# EAGLE design Clockdistributor (EAGLE 9.3.1)
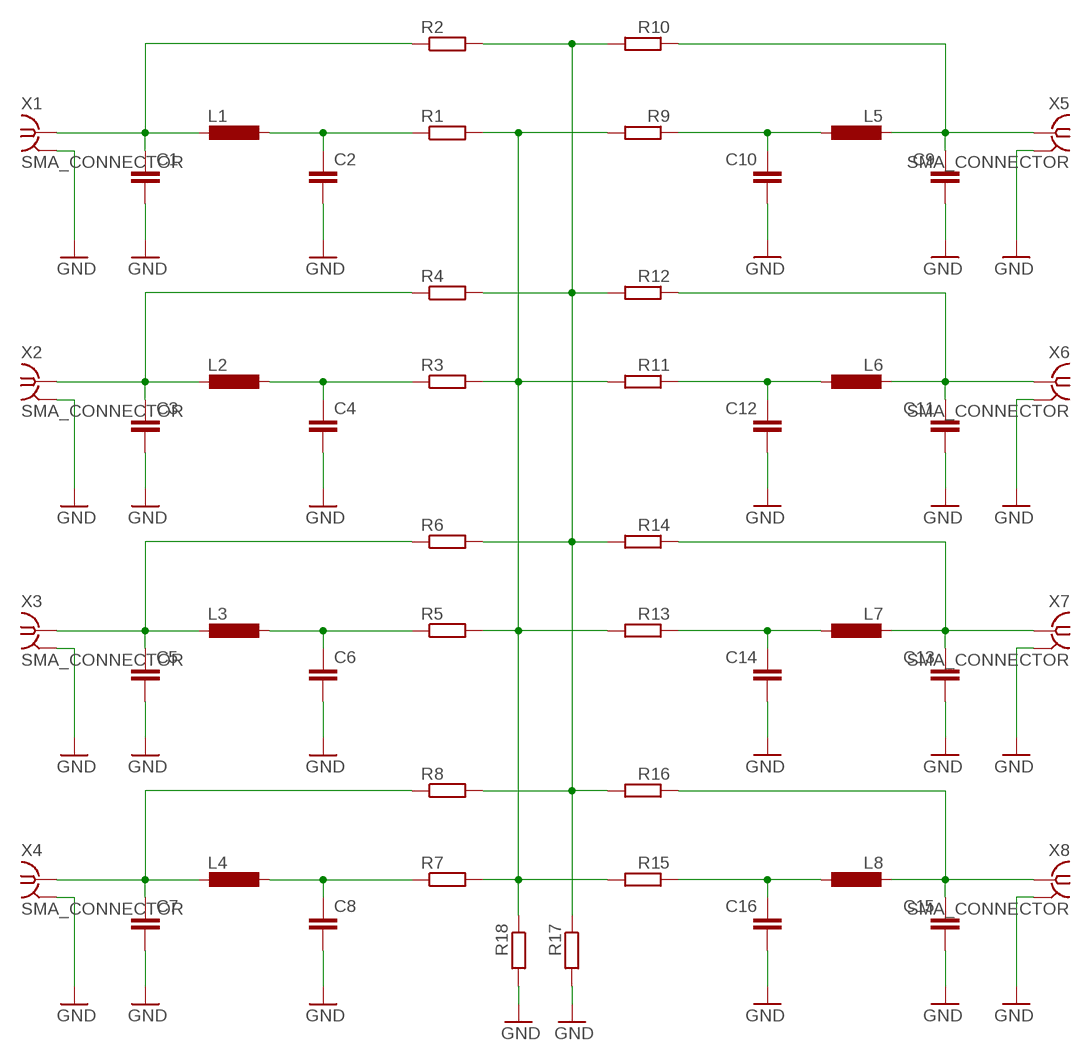
[diagram p0: schematic, sheet 1]

## Parts
C1  C-EUC0603  [C0603]
C2  C-EUC0603  [C0603]
C3  C-EUC0603  [C0603]
C4  C-EUC0603  [C0603]
C5  C-EUC0603  [C0603]
C6  C-EUC0603  [C0603]
C7  C-EUC0603  [C0603]
C8  C-EUC0603  [C0603]
C9  C-EUC0603  [C0603]
C10  C-EUC0603  [C0603]
C11  C-EUC0603  [C0603]
C12  C-EUC0603  [C0603]
C13  C-EUC0603  [C0603]
C14  C-EUC0603  [C0603]
C15  C-EUC0603  [C0603]
C16  C-EUC0603  [C0603]
L1  L-EUL2012C  [L2012C]
L2  L-EUL2012C  [L2012C]
L3  L-EUL2012C  [L2012C]
L4  L-EUL2012C  [L2012C]
L5  L-EUL2012C  [L2012C]
L6  L-EUL2012C  [L2012C]
L7  L-EUL2012C  [L2012C]
L8  L-EUL2012C  [L2012C]
R1  R-EU_R0603  [R0603]
R2  R-EU_R0603  [R0603]
R3  R-EU_R0603  [R0603]
R4  R-EU_R0603  [R0603]
R5  R-EU_R0603  [R0603]
R6  R-EU_R0603  [R0603]
R7  R-EU_R0603  [R0603]
R8  R-EU_R0603  [R0603]
R9  R-EU_R0603  [R0603]
R10  R-EU_R0603  [R0603]
R11  R-EU_R0603  [R0603]
R12  R-EU_R0603  [R0603]
R13  R-EU_R0603  [R0603]
R14  R-EU_R0603  [R0603]
R15  R-EU_R0603  [R0603]
R16  R-EU_R0603  [R0603]
R17  R-EU_R0603  [R0603]
R18  R-EU_R0603  [R0603]
X1  SMA_CONNECTOR  [J502-ND-142-0711-821/826]
X2  SMA_CONNECTOR  [J502-ND-142-0711-821/826]
X3  SMA_CONNECTOR  [J502-ND-142-0711-821/826]
X4  SMA_CONNECTOR  [J502-ND-142-0711-821/826]
X5  SMA_CONNECTOR  [J502-ND-142-0711-821/826]
X6  SMA_CONNECTOR  [J502-ND-142-0711-821/826]
X7  SMA_CONNECTOR  [J502-ND-142-0711-821/826]
X8  SMA_CONNECTOR  [J502-ND-142-0711-821/826]

## Nets
GND: C1.2 C2.2 C3.2 C4.2 C5.2 C6.2 C7.2 C8.2 C9.2 C10.2 C11.2 C12.2 C13.2 C14.2 C15.2 C16.2 R17.2 R18.2 X1.G@1 X1.G@2 X1.G@3 X1.G@4 X2.G@1 X2.G@2 X2.G@3 X2.G@4 X3.G@1 X3.G@2 X3.G@3 X3.G@4 X4.G@1 X4.G@2 X4.G@3 X4.G@4 X5.G@1 X5.G@2 X5.G@3 X5.G@4 X6.G@1 X6.G@2 X6.G@3 X6.G@4 X7.G@1 X7.G@2 X7.G@3 X7.G@4 X8.G@1 X8.G@2 X8.G@3 X8.G@4
N$1: C1.1 L1.2 R2.1 X1.1
N$2: C2.1 L1.1 R1.1
N$3: C3.1 L2.2 R4.1 X2.1
N$4: C4.1 L2.1 R3.1
N$5: C5.1 L3.2 R6.1 X3.1
N$6: C6.1 L3.1 R5.1
N$7: C7.1 L4.2 R8.1 X4.1
N$8: C8.1 L4.1 R7.1
N$9: C9.1 L5.2 R10.1 X5.1
N$10: C10.1 L5.1 R9.1
N$11: C11.1 L6.2 R12.1 X6.1
N$12: C12.1 L6.1 R11.1
N$13: C13.1 L7.2 R14.1 X7.1
N$14: C14.1 L7.1 R13.1
N$15: C15.1 L8.2 R16.1 X8.1
N$16: C16.1 L8.1 R15.1
N$17: R2.2 R4.2 R6.2 R8.2 R10.2 R12.2 R14.2 R16.2 R17.1
N$21: R1.2 R3.2 R5.2 R7.2 R9.2 R11.2 R13.2 R15.2 R18.1

## Library data of the parts
C1-C16 = rcl:C-EU: CAPACITOR, European symbol
L1-L8 = rcl:L-EU: INDUCTOR, European symbol
R1-R18 = resistor:R-EU_: RESISTOR, European symbol
X1-X8 = rf:SMA_CONNECTOR

## Board
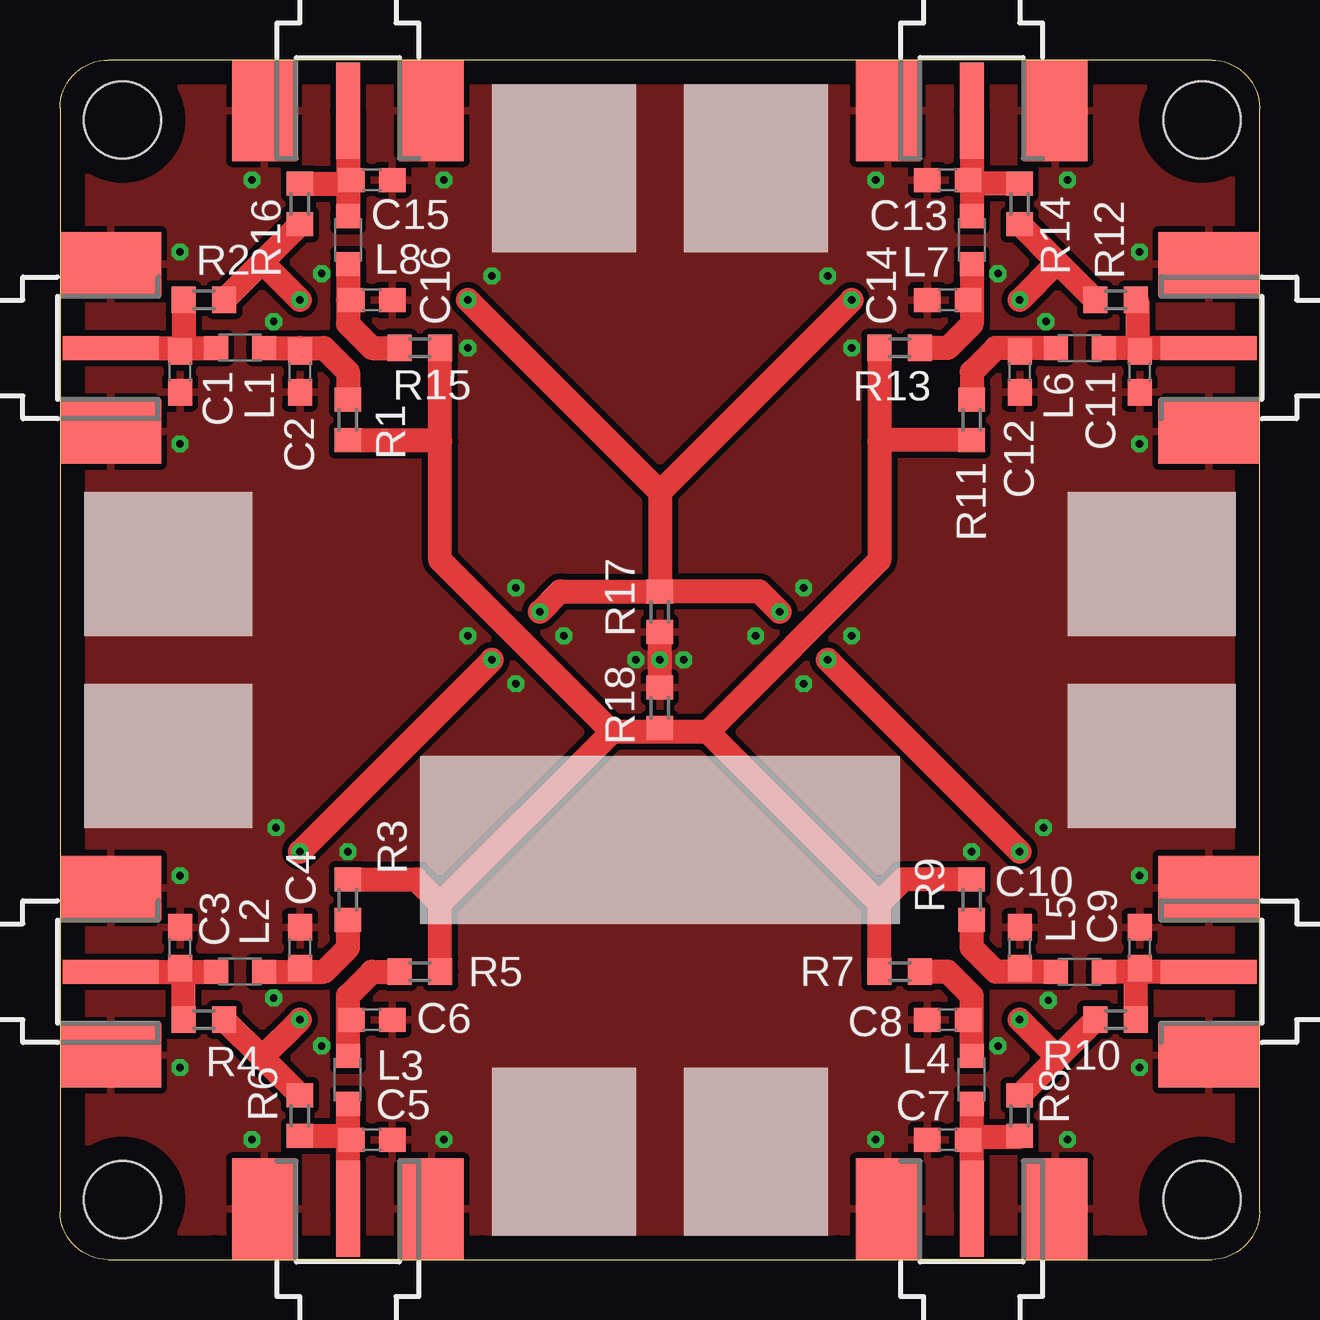
[diagram p1: board, top side]
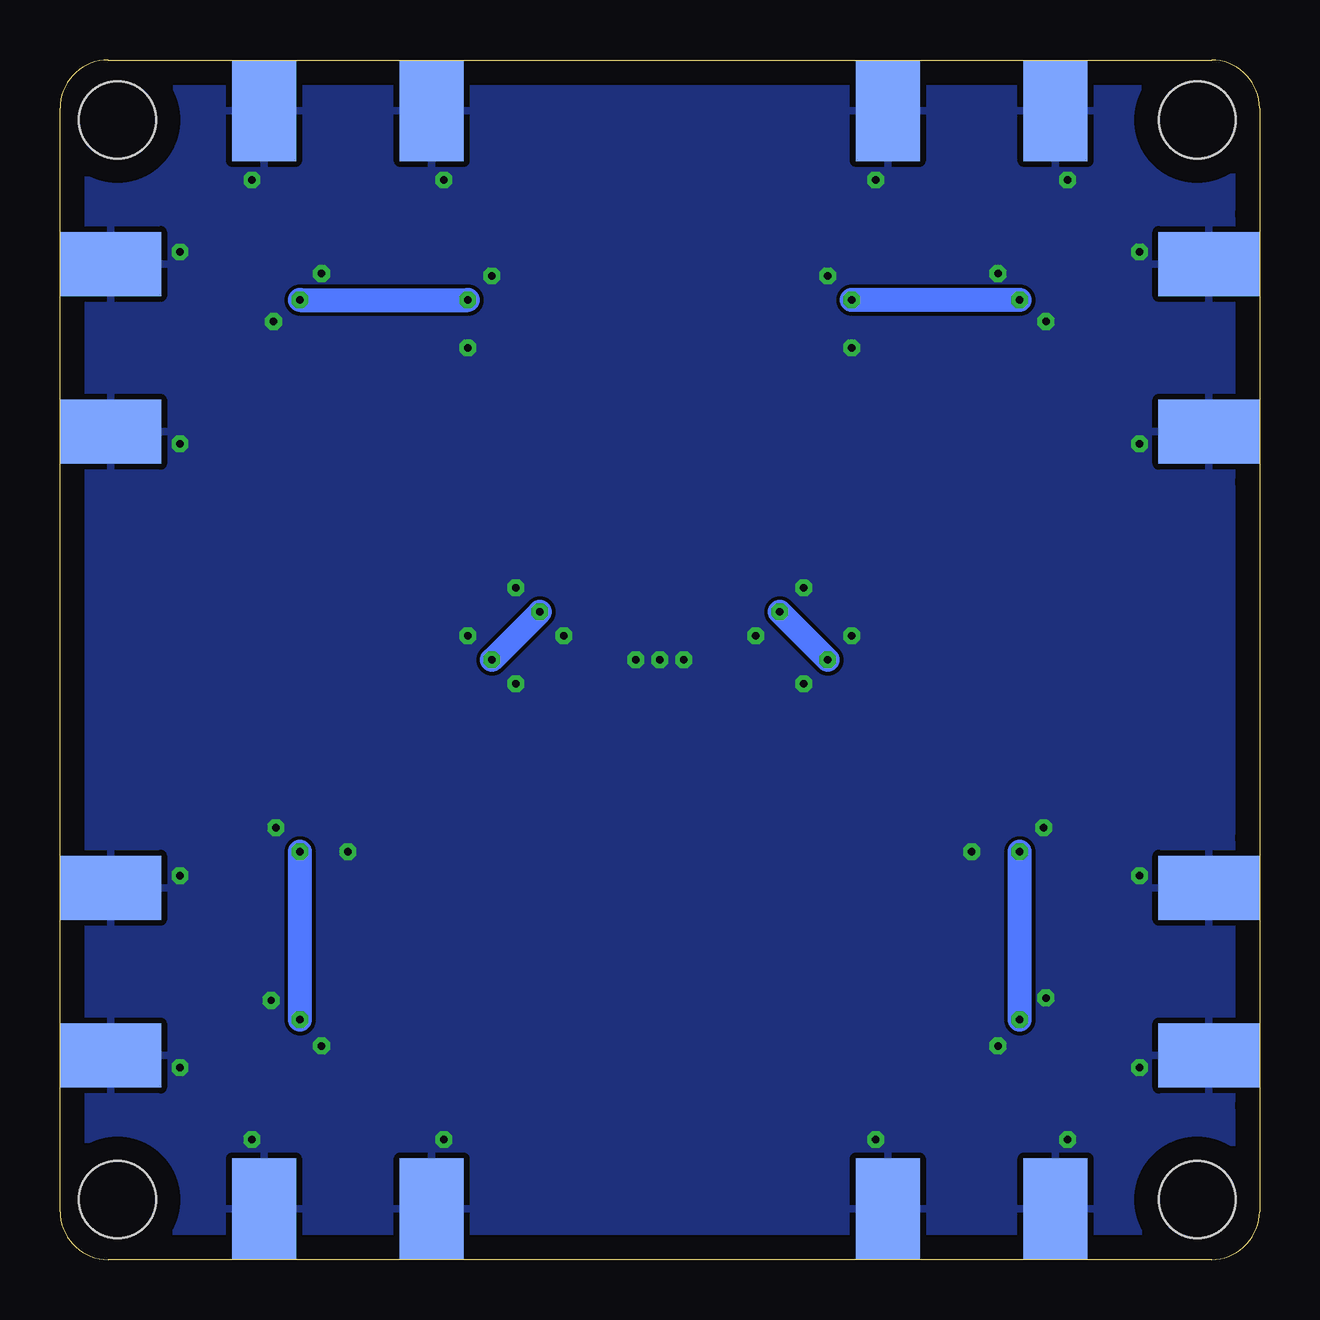
[diagram p2: board, bottom side, seen from below]

Size 50 x 50 mm. Coordinates in mm from the lower left corner, seen from the top.
Outline: 0,48 0,2 arc90 2,0 48,0 arc90 50,2 50,48 arc90 48,50 2,50 arc90 0,48
Copper layers (1*16): Top 0.035mm / dielectric 1.5mm / Bottom 0.035mm
Design rules "default *": minimum track width 6mil, minimum drill 0.3mm, track to track 6mil, track to pad 6mil, pad to pad 6mil, via to via 6mil, smd to smd 6mil, copper to edge 40mil, drill to drill 6mil, minimum pad ring 10mil, minimum via ring 8mil, stop-mask expansion 4mil, vias tented up to drill 0mil, thermal gap 10mil
Holes 3.2 mm at 2.6,47.5 47.6,47.5 47.6,2.5 2.6,2.5

### Footprints (pad centres in the part's own frame; a part is rotated, then mirrored left to right if it is on the bottom)
C0603 = smd 1.1 x 1: 1 -0.85,0; 2 0.85,0
L2012C = smd 1 x 1: 1 -1,0; 2 1,0
R0603 = smd 1 x 1.1: 1 -0.85,0; 2 0.85,0
J502-ND-142-0711-821/826 = smd 4 x 1: 1 2.115,0 | smd 4.191 x 2.667: G@1 2.115,3.495; G@2 2.115,-3.495 | smd 4.191 x 2.667 bottom: G@3 2.115,3.495; G@4 2.115,-3.495

### Placement (x,y rotation side)
C1  5,37 270 top
C2  10,37 270 top
C3  5,13 90 top
C4  10,13 90 top
C5  13,5 0 top
C6  13,10 0 top
C7  37,5 180 top
C8  37,10 180 top
C9  45,13 90 top
C10  40,13 90 top
C11  45,37 270 top
C12  40,37 270 top
C13  37,45 180 top
C14  37,40 180 top
C15  13,45 0 top
C16  13,40 0 top
L1  7.5,38 180 top
L2  7.5,12 180 top
L3  12,7.5 270 top
L4  38,7.5 270 top
L5  42.5,12 0 top
L6  42.5,38 0 top
L7  38,42.5 90 top
L8  12,42.5 90 top
R1  12,35 270 top
R2  6,40 0 top
R3  12,15 90 top
R4  6,10 0 top
R5  15,12 0 top
R6  10,6 90 top
R7  35,12 180 top
R8  40,6 90 top
R9  38,15 90 top
R10  44,10 180 top
R11  38,35 270 top
R12  44,40 180 top
R13  35,38 180 top
R14  40,44 270 top
R15  15,38 0 top
R16  10,44 270 top
R17  25,27 270 top
R18  25,23 90 top
X1  0,38 0 top
X2  0,12 0 top
X3  12,0 90 top
X4  38,0 90 top
X5  50,12 180 top
X6  50,38 180 top
X7  38,50 270 top
X8  12,50 270 top

### Tracks (layer width: path | path; a pad name or v marks a point on that pad's centre or on a via)
GND  (via drill 0.3)
  Top 0.305: X3.G@1 8,2.12 8,4
  Top 1: R18.2 v25,25 R17.2
  other vias: 29,26 31,28 33,26 31,24 21,26 19,28 19,24 17,26 10.9,41.1 8.9,39.1 39.1,41.1 41.1,39.1 41.2,10.8 39.1,8.9 10.9,8.9 8.9,10.9 9,18 12,17 41,18 38,17 32,41 33,38 18,41 17,38 5,42 8,45 16,45 5,34 5,16 5,8 8,5 16,5 34,5 42,5 45,8 45,16 45,34 45,42 42,45 34,45 26,25 24,25
  pour Top (isolate 0.254): -2.7,52.7 54.7,52.7 54.7,-2.7 -2.8,-2.7 -2.8,52.7
  pour Bottom: -2.1,52.1 53.5,52.1 53.5,-1.6 -2.1,-1.6
N$1
  Top 1: X1.1 5.1,38 | 5.1,38 L1.2 | R2.1 5.15,38.05 5.1,38 | C1.1 5,37.9 5.1,38
N$2
  Top 1: L1.1 10,38 | 10,38 11,38 12,37 R1.1 | C2.1 10,38
N$3
  Top 1: X2.1 5,12 | 5,12 L2.2 | R4.1 5.15,11.85 5,12 | C3.1 5,12
N$4
  Top 1: L2.1 10,12 | 10,12 11,12 12,13 R3.1 | C4.1 10,12
N$5
  Top 0.305: C5.1 12,5 12,5.1
  Top 1: X3.1 12,5.1 | 12,5.1 L3.2 | R6.1 11.95,5.15 12,5.1
N$6
  Top 1: L3.1 12,10 | 12,10 12,11 13,12 R5.1 | C6.1 12,10
N$7
  Top 1: X4.1 38,5.1 | 38,5.1 L4.2 | R8.1 39.95,5.1 38,5.1 | C7.1 37.9,5 38,5.1
N$8
  Top 0.305: C8.1 38,10
  Top 1: L4.1 38,10 38,11 37,12 R7.1
N$9
  Top 1: X5.1 45,12 | 45,12 L5.2 | C9.1 45,12 | R10.1 44.85,11.85 45,12
N$10
  Top 1: L5.1 40,12 | 40,12 39,12 38,13 R9.1 | C10.1 40,12
N$11
  Top 1: X6.1 44.9,38 | 44.9,38 L6.2 | R12.1 44.9,39.95 44.9,38 | C11.1 44.9,37.95 44.9,38
N$12
  Top 1: L6.1 39.8,38 | 39.8,38 39,38 38,37 R11.1 | C12.1 39.95,37.85 39.8,38
N$13
  Top 1: X7.1 38,44.9 | 38,44.9 L7.2 | R14.1 38.05,44.85 38,44.9 | C13.1 37.9,45 38,44.9
N$14
  Top 1: L7.1 38,40.1 | 38,40.1 38,39 37,38 R13.1 | C14.1 37.9,40 38,40.1
N$15
  Top 1: X8.1 12,45 | 12,45 L8.2 | C15.1 12,45 | R16.1 11.85,44.85 12,45
N$16
  Top 1: L8.1 12,40 | 12,40 12,39 13,38 R15.1 | C16.1 12,40
N$17  (via drill 0.3)
  Top 1: R4.2 8.43,8.43 | 8.43,8.43 R6.2 | R8.2 41.62,8.47 | 41.62,8.47 R10.2 | R12.2 41.52,41.62 | 41.52,41.62 R14.2 | R16.2 8.28,41.42 | 8.28,41.42 R2.2 | 8.28,41.42 8.57,41.42 v10,40 | v17,40 25,32 | 25,32 R17.1 | 41.52,41.62 41.52,41.52 v40,40 | v33,40 25,32 | 41.62,8.47 41.52,8.47 v40,10 | v40,17 v32,25 | v30,27 29.15,27.85 R17.1 | 8.43,8.43 v10,10 | v10,17 v18,25 | v20,27 20.85,27.85 R17.1
  Bottom 1: v10,40 v17,40 | v40,40 v33,40 | v40,10 v40,17 | v32,25 v30,27 | v10,10 v10,17 | v18,25 v20,27
N$21
  Top 0.305: R18.1 25.1,22.15 25.1,22
  Top 1: R13.2 34.15,34.1 | 34.15,34.1 34.15,29.15 27,22 | 27,22 25.1,22 23,22 | 23,22 15.85,29.15 15.85,34.1 | 15.85,34.1 R15.2 | R1.2 15.8,34.15 15.85,34.1 | R11.2 34.2,34.15 34.15,34.1 | R7.2 34.15,14.85 | 34.15,14.85 27,22 | R9.2 35.15,15.85 34.15,14.85 | R5.2 15.85,14.85 | 15.85,14.85 23,22 | R3.2 14.85,15.85 15.85,14.85